# EAGLE design LPC_4TE_3.31 (EAGLE 5.00)
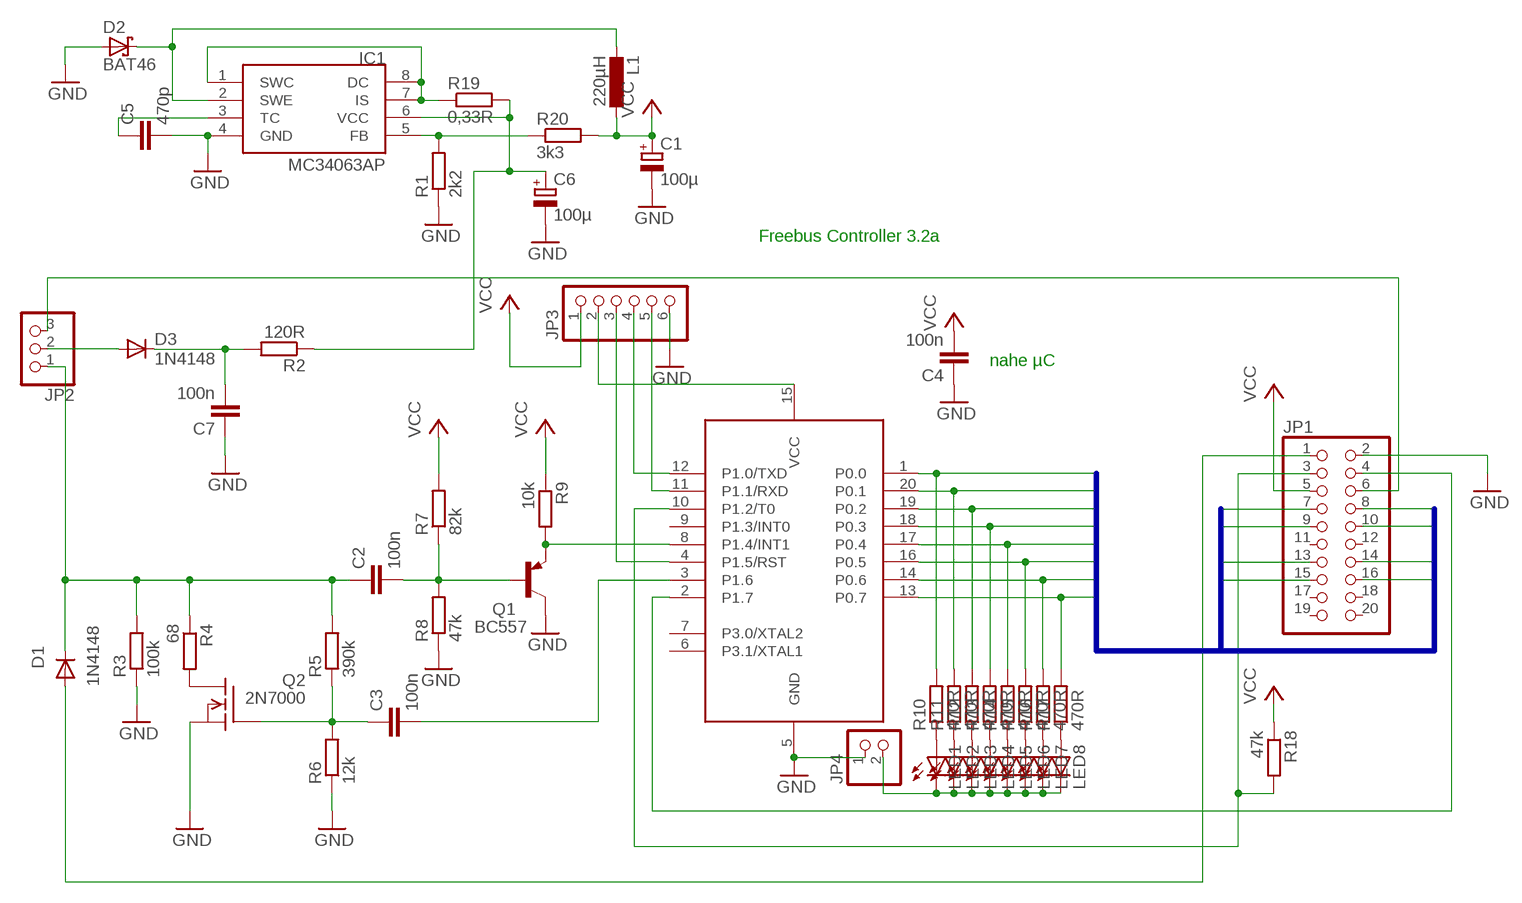
[diagram p0: schematic, sheet 1]

## Parts
C1  100µ  CPOL-EUE5-8.5  [E5-8,5]
C2  100n  C-EU050-024X044  [C050-024X044]
C3  100n  C-EU050-024X044  [C050-024X044]
C4  100n  C-EU050-024X044  [C050-024X044]
C5  470p  C-EU025-024X044  [C025-024X044]
C6  100µ  CPOL-EUE5-8.5  [E5-8,5]
C7  100n  C-EU050-024X044  [C050-024X044]
D1  1N4148  [DO35-10]
D2  BAT46  BAT49  [DO41-10]
D3  1N4148  [DO35-10]
IC1  MC34063AP  [DIL08]
JP1  PINHD-2X10  [2X10]
JP2  PINHD-1X3  [1X03]
JP3  PINHD-1X6  [1X06]
JP4  PINHD-1X2  [1X02]
L1  220µH  L-EU2200-12.7  [2200-12.7]
LED1  LED3MM  [LED3MM]
LED2  LED3MM  [LED3MM]
LED3  LED3MM  [LED3MM]
LED4  LED3MM  [LED3MM]
LED5  LED3MM  [LED3MM]
LED6  LED3MM  [LED3MM]
LED7  LED3MM  [LED3MM]
LED8  LED3MM  [LED3MM]
Q1  BC557  [TO92]
Q2  2N7000  VN2222KM  [TO237]
R1  2k2  R-EU_0207/10  [0207/10]
R2  120R  R-EU_0207/10  [0207/10]
R3  100k  R-EU_0207/10  [0207/10]
R4  68  R-EU_0207/10  [0207/10]
R5  390k  R-EU_0207/10  [0207/10]
R6  12k  R-EU_0207/10  [0207/10]
R7  82k  R-EU_0207/10  [0207/10]
R8  47k  R-EU_0207/10  [0207/10]
R9  10k  R-EU_0207/10  [0207/10]
R10  470R  R-EU_0207/10  [0207/10]
R11  470R  R-EU_0207/10  [0207/10]
R12  470R  R-EU_0207/10  [0207/10]
R13  470R  R-EU_0207/10  [0207/10]
R14  470R  R-EU_0207/10  [0207/10]
R15  470R  R-EU_0207/10  [0207/10]
R16  470R  R-EU_0207/10  [0207/10]
R17  470R  R-EU_0207/10  [0207/10]
R18  47k  R-EU_0207/10  [0207/10]
R19  0,33R  R-EU_0207/10  [0207/10]
R20  3k3  R-EU_0207/10  [0207/10]
U1  89LPC922  [DIL20]

## Nets
GND: C1.- C4.1 C5.2 C6.- C7.1 D2.A IC1.4(GND) JP1.2 JP3.6 JP4.1 Q1.3(C) Q2.3(S) R1.1 R3.1 R6.1 R8.1 U1.5(GND)
N$1: Q1.1(E) R9.2 U1.8(P1.4/INT1)
N$2: C2.2 Q1.2(B) R7.1 R8.2
N$3: IC1.5(FB) R1.2 R20.1
N$4: IC1.1(SWC) IC1.7(IS) IC1.8(DC) R19.1
N$5: C3.2 U1.3(P1.6)
N$6: Q2.1(D) R4.2
N$7: C6.+ IC1.6(VCC) R2.1 R19.2
N$8: D3.A JP2.2
N$9: C2.1 D1.C JP2.1 R3.2 R4.1 R5.2
N$10: D2.C IC1.2(SWE) L1.2
N$11: C7.2 D3.C R2.2
N$13: C5.1 IC1.3(TC)
N$16: D1.A JP1.1
N$17: JP1.4 U1.2(P1.7)
N$19: JP1.6 JP2.3
N$20: LED1.A R10.1
N$21: LED2.A R11.1
N$22: LED3.A R12.1
N$23: LED4.A R13.1
N$24: LED5.A R14.1
N$25: LED6.A R15.1
N$26: LED7.A R16.1
N$27: LED8.A R17.1
N$28: JP4.2 LED1.K(C) LED2.K(C) LED3.K(C) LED4.K(C) LED5.K(C) LED6.K(C) LED7.K(C) LED8.K(C)
N$29: JP3.4 U1.12(P1.0/TXD)
N$30: JP3.5 U1.11(P1.1/RXD)
N$31: JP3.3 U1.4(P1.5/RST)
N$32: JP3.2 U1.15(VCC)
N$33: JP1.3 R18.2 U1.10(P1.2/T0)
N$34: C3.1 Q2.2(G) R5.1 R6.2
P0.0: JP1.7 R10.2 U1.1(P0.0)
P0.1: JP1.8 R11.2 U1.20(P0.1)
P0.2: JP1.9 R12.2 U1.19(P0.2)
P0.3: JP1.10 R13.2 U1.18(P0.3)
P0.4: JP1.13 R14.2 U1.17(P0.4)
P0.5: JP1.14 R15.2 U1.16(P0.5)
P0.6: JP1.15 R16.2 U1.14(P0.6)
P0.7: JP1.16 R17.2 U1.13(P0.7)
VCC: C1.+ C4.2 JP1.5 JP3.1 L1.1 R7.2 R9.1 R18.1 R20.2
Unconnected: JP1.11 JP1.12 JP1.17 JP1.18 JP1.19 JP1.20 U1.6(P3.1/XTAL1) U1.7(P3.0/XTAL2) U1.9(P1.3/INT0)

## Buses
P0.[0..7]

## Notes on the sheet
- Freebus Controller 3.2a
- nahe µC

## Library data of the parts
C1 C6 = rcl:CPOL-EU: POLARIZED CAPACITOR, European symbol
C2-C5 C7 = rcl:C-EU: CAPACITOR, European symbol
D1 D3 = diode:1N4148: DIODE high speed (Philips)
D2 = diode:BAT49: DIODE small signal diode
IC1 = mc34063:MC34063
JP1 = pinhead:PINHD-2X10: PIN HEADER
JP2 = pinhead:PINHD-1X3: PIN HEADER
JP3 = pinhead:PINHD-1X6: PIN HEADER
JP4 = pinhead:PINHD-1X2: PIN HEADER
L1 = rcl:L-EU: INDUCTOR, European symbol
LED1-LED8 = led:LED: LED OSRAM: - CHIPLED LG R971, LG N971, LY N971, LG Q971, LY Q971, LO R971, LY R971 LH N974, LH R974 LS Q976, LO Q976, LY Q976 LO Q996 - Hyper CHIPLED LW Q18S LB Q993, LB Q99A, LB R99A - SideLED LS A670, LO A670, LY A670, LG A670, LP A670 LB A673, LV A673, LT A673, LW A673 LH A674 LY A675 LS A676, LA A676, LO A676, LY A676, LW A676 LS A679, LY A679, LG A679 - Hyper Micro SIDELED® LS Y876, LA Y876, LO Y876, LY Y876 LT Y87S - SmartLED LW L88C, LW L88S LB L89C, LB L89S, LG L890 LS L89K, LO L89K, LY L89K LS L896, LA L896, LO L896, LY L896 - TOPLED LS T670, LO T670, LY T670, LG T670, LP T670 LSG T670, LSP T670, LSY T670, LOP T670, LYG T670 LG T671, LOG T671, LSG T671 LB T673, LV T673, LT T673, LW T673 LH T674 LS T676, LA T676, LO T676, LY T676, LB T676, LH T676, LSB T676, LW T676 LB T67C, LV T67C, LT T67C, LS T67K, LO T67K, LY T67K, LW E67C LS E67B, LA E67B, LO E67B, LY E67B, LB E67C, LV E67C, LT E67C LW T67C LS T679, LY T679, LG T679 LS T770, LO T770, LY T770, LG T770, LP T770 LB T773, LV T773, LT T773, LW T773 LH T774 LS E675, LA E675, LY E675, LS T675 LS T776, LA T776, LO T776, LY T776, LB T776 LHGB T686 LT T68C, LB T68C - Hyper Mini TOPLED® LB M676 - Mini TOPLED Santana® LG M470 LS M47K, LO M47K, LY M47K Source: http://www.osram.convergy.de - LUMILED® LXK2-PW12-R00, LXK2-PW12-S00, LXK2-PW14-U00, LXK2-PW14-V00 LXK2-PM12-R00, LXK2-PM12-S00, LXK2-PM14-U00 LXK2-PE12-Q00, LXK2-PE12-R00, LXK2-PE12-S00, LXK2-PE14-T00, LXK2-PE14-U00 LXK2-PB12-K00, LXK2-PB12-L00, LXK2-PB12-M00, LXK2-PB14-N00, LXK2-PB14-P00, LXK2-PB14-Q00 LXK2-PR12-L00, LXK2-PR12-M00, LXK2-PR14-Q00, LXK2-PR14-R00 LXK2-PD12-Q00, LXK2-PD12-R00, LXK2-PD12-S00 LXK2-PH12-R00, LXK2-PH12-S00 LXK2-PL12-P00, LXK2-PL12-Q00, LXK2-PL12-R00 Source: www.luxeon.com
Q1 = transistor-pnp:BC557: PNP Transistor
Q2 = transistor-fet:VN2222KM: N-Channel Enhancement MOSFET (VMOS); 60V; 0,5A; 7,5Ohm
R1-R20 = rcl:R-EU_: RESISTOR, European symbol
U1 = micro-philips:89LPC922

## Board
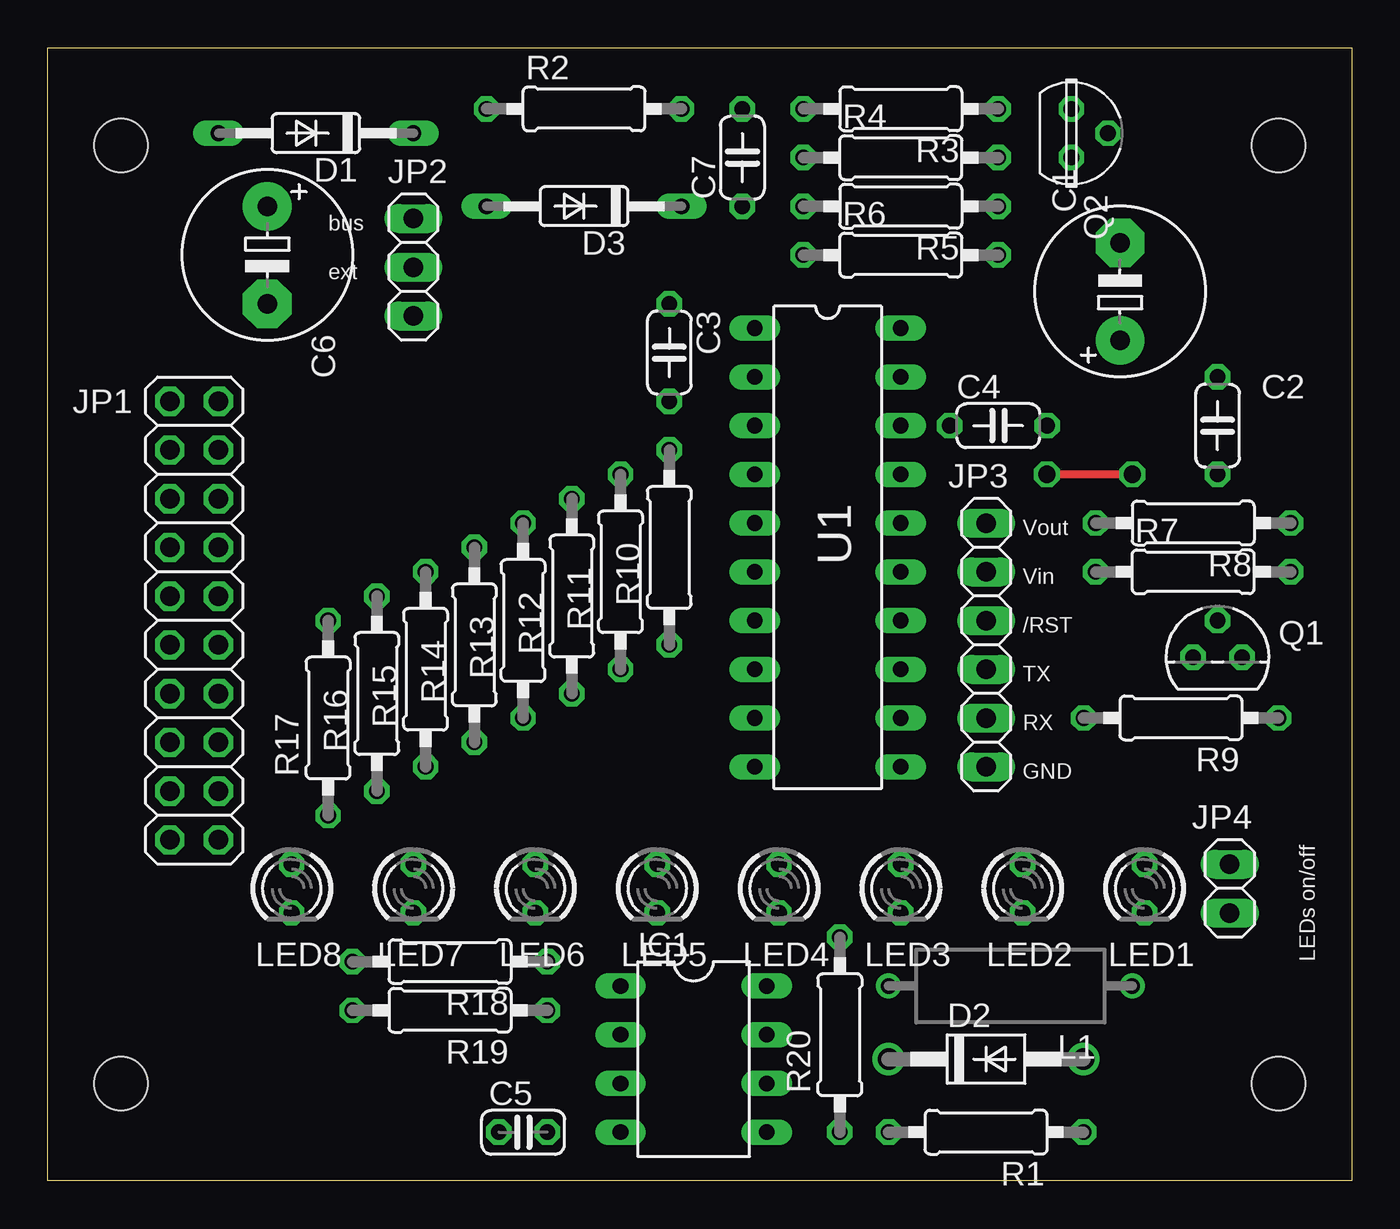
[diagram p1: board, top side]
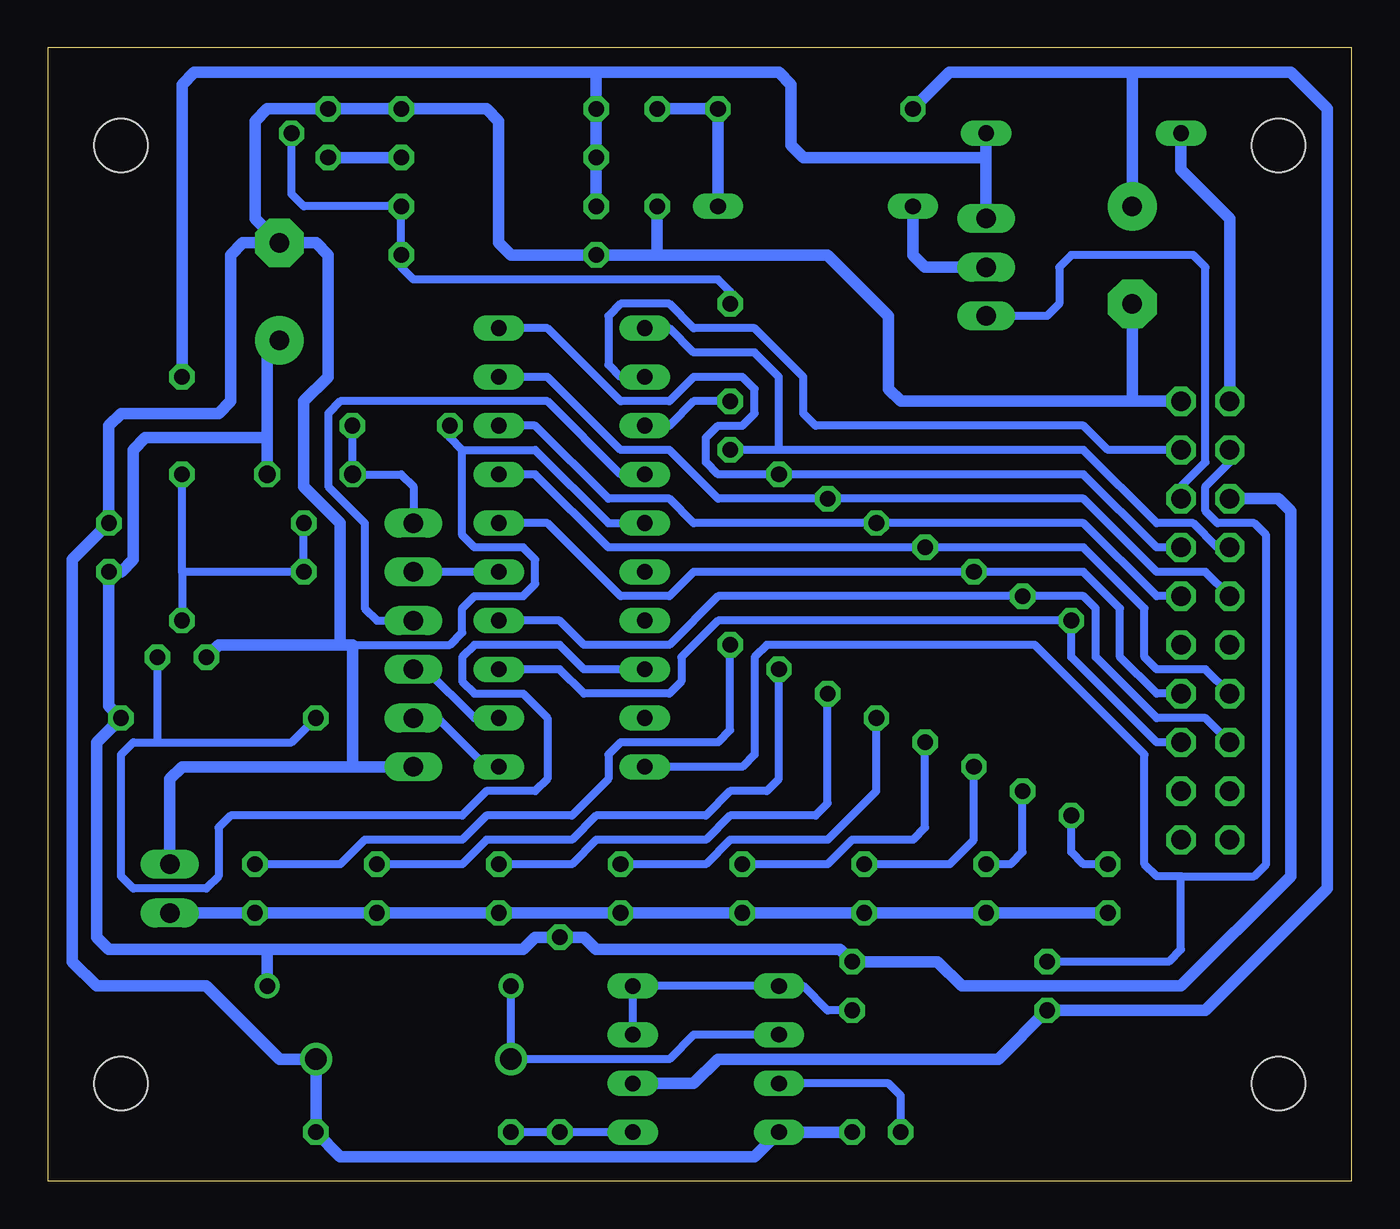
[diagram p2: board, bottom side, seen from below]

Size 67.94 x 59.05 mm. Coordinates in mm from the lower left corner, seen from the top.
Outline: 0,0 0,59.05 67.94,59.05 67.94,0 0,0
Copper layers (1*16): Top 0.035mm / dielectric 1.5mm / Bottom 0.035mm
Design rules "default": minimum track width 10mil, minimum drill 24mil, track to track 12mil, track to pad 12mil, pad to pad 12mil, via to via 12mil, smd to smd 8mil, copper to edge 20mil, drill to drill 8mil, minimum pad ring 10mil, minimum via ring 8mil, stop-mask expansion 4mil, vias tented up to drill 0mil, thermal gap 10mil
Holes 2.8 mm at 3.81,53.98 64.14,53.98 64.14,5.08 3.81,5.08

### Footprints (pad centres in the part's own frame; a part is rotated, then mirrored left to right if it is on the bottom)
E5-8,5 = drill 1.016 pad 2.54 round: + -2.54,0 | drill 1.016 pad 2.54 octagon: - 2.54,0
C050-024X044 = drill 0.813 octagon: 1 -2.54,0; 2 2.54,0
C025-024X044 = drill 0.813 octagon: 1 -1.27,0; 2 1.27,0
DO35-10 = drill 0.813 long: A 5.08,0; C -5.08,0
DO41-10 = drill 1.118 round: A 5.08,0; C -5.08,0
DIL08 = drill 0.813 long: 1 -3.81,-3.81; 2 -1.27,-3.81; 3 1.27,-3.81; 4 3.81,-3.81; 5 3.81,3.81; 6 1.27,3.81; 7 -1.27,3.81; 8 -3.81,3.81
2X10 = drill 1.016 octagon: 1 -11.43,-1.27; 2 -11.43,1.27; 3 -8.89,-1.27; 4 -8.89,1.27; 5 -6.35,-1.27; 6 -6.35,1.27; 7 -3.81,-1.27; 8 -3.81,1.27; 9 -1.27,-1.27; 10 -1.27,1.27; 11 1.27,-1.27; 12 1.27,1.27; 13 3.81,-1.27; 14 3.81,1.27; 15 6.35,-1.27; 16 6.35,1.27; 17 8.89,-1.27; 18 8.89,1.27; 19 11.43,-1.27; 20 11.43,1.27
1X03 = drill 1.016 long: 1 -2.54,0; 2 0,0; 3 2.54,0
1X06 = drill 1.016 long: 1 -6.35,0; 2 -3.81,0; 3 -1.27,0; 4 1.27,0; 5 3.81,0; 6 6.35,0
1X02 = drill 1.016 long: 1 -1.27,0; 2 1.27,0
2200-12.7 = drill 0.8 pad 1.27 round: 1 -6.35,0; 2 6.35,0
LED3MM = drill 0.813 octagon: A -1.27,0; K 1.27,0
TO92 = drill 0.813 octagon: 1 1.27,0; 2 0,1.905; 3 -1.27,0
TO237 = drill 0.813 octagon: 1 1.27,0; 2 0,1.905; 3 -1.27,0
0207/10 = drill 0.813 octagon: 1 -5.08,0; 2 5.08,0
DIL20 = drill 0.813 long: 1 -11.43,-3.81; 2 -8.89,-3.81; 3 -6.35,-3.81; 4 -3.81,-3.81; 5 -1.27,-3.81; 6 1.27,-3.81; 7 3.81,-3.81; 8 6.35,-3.81; 9 8.89,-3.81; 10 11.43,-3.81; 11 11.43,3.81; 12 8.89,3.81; 13 6.35,3.81; 14 3.81,3.81; 15 1.27,3.81; 16 -1.27,3.81; 17 -3.81,3.81; 18 -6.35,3.81; 19 -8.89,3.81; 20 -11.43,3.81

### Placement (x,y rotation side)
C1  55.88,46.35 90 top
C2  60.96,39.37 270 top
C3  32.38,43.18 270 top
C4  49.53,39.37 0 top
C5  24.77,2.54 0 top
C6  11.43,48.26 270 top
C7  36.2,53.34 90 top
D1  13.97,54.61 180 top
D2  48.9,6.35 0 top
D3  27.94,50.8 180 top
IC1  33.66,6.35 270 top
JP1  7.62,29.21 270 top
JP2  19.05,47.62 270 top
JP3  48.9,27.94 270 top
JP4  61.59,15.24 270 top
L1  50.16,10.16 180 top
LED1  57.15,15.24 270 top
LED2  50.8,15.24 270 top
LED3  44.45,15.24 270 top
LED4  38.1,15.24 270 top
LED5  31.75,15.24 270 top
LED6  25.4,15.24 270 top
LED7  19.05,15.24 270 top
LED8  12.7,15.24 270 top
Q1  60.96,27.3 0 top
Q2  53.34,54.61 270 top
R1  48.9,2.54 180 top
R2  27.94,55.88 0 top
R3  44.45,55.88 180 top
R4  44.45,53.34 0 top
R5  44.45,50.8 180 top
R6  44.45,48.26 0 top
R7  59.69,31.75 0 top
R8  59.69,34.29 180 top
R9  59.05,24.13 180 top
R10  32.38,33.02 90 top
R11  29.84,31.75 90 top
R12  27.3,30.48 90 top
R13  24.77,29.21 90 top
R14  22.23,27.94 90 top
R15  19.68,26.67 90 top
R16  17.14,25.4 90 top
R17  14.61,24.13 90 top
R18  20.95,11.43 180 top
R19  20.95,8.89 180 top
R20  41.27,7.62 90 top
U1  40.64,33.02 270 top

### Tracks (layer width: path | path; a pad name or v marks a point on that pad's centre or on a via)
GND
  Bottom 0.406: U1.5 38.73,34.29 42.55,38.1 46.35,38.1 | 52.07,27.94 46.99,27.94 46.35,28.57 46.35,29.84 45.72,30.48 43.18,30.48 42.55,31.11 42.55,32.38 43.18,33.02 45.72,33.02 46.35,33.66 46.35,38.1 | C4.1 46.99,38.73 46.35,38.1
  Bottom 0.61: JP1.2 11.43,40.64 | 11.43,40.64 23.5,40.64 24.13,41.27 24.13,45.09 27.3,48.26 36.2,48.26 | JP4.1 61.59,20.95 60.96,21.59 52.07,21.59 | 52.07,21.59 JP3.6 | 52.07,21.59 52.07,27.94 52.7,27.94 | 52.7,27.94 59.05,27.94 Q1.3 | 11.43,40.64 C6.- | 36.2,48.26 R6.1 43.81,48.26 44.45,48.9 44.45,55.24 45.09,55.88 R3.1 Q2.3 56.52,55.88 57.15,55.24 57.15,50.16 C1.- | 52.7,27.94 52.7,34.29 54.61,36.2 54.61,40.64 53.34,41.91 53.34,48.26 53.98,48.9 C1.- | 36.2,48.26 C7.1 | C1.- 57.78,48.9 58.42,48.26 58.42,40.64 59.05,40.01 64.14,40.01 64.77,39.37 R8.1 66.67,32.38 66.67,11.43 65.41,10.16 59.69,10.16 55.88,6.35 D2.A R1.1 52.7,1.27 31.11,1.27 IC1.4 C5.2
N$1
  Bottom 0.406: U1.8 40.01,26.67 41.27,27.94 45.72,27.94 46.35,27.3 46.35,26.04 45.72,25.4 43.18,25.4 41.91,24.13 41.91,20.95 42.55,20.32 45.09,20.32 46.35,19.05 58.42,19.05 59.05,18.41 59.05,15.88 59.69,15.24 63.5,15.24 64.14,15.88 64.14,22.23 63.5,22.86 62.23,22.86 | 62.23,22.86 55.24,22.86 R9.2 | 62.23,22.86 Q1.1
N$2
  Bottom 0.406: 60.96,31.75 Q1.2 | 60.96,31.75 R7.1 R8.2 | 60.96,31.75 C2.2
N$3
  Bottom 0.406: IC1.5 R20.1 R1.2
N$4
  Bottom 0.406: IC1.7 IC1.8 IC1.1 28.57,10.16 27.3,8.89 R19.1
N$5
  Bottom 0.406: C3.2 34.29,40.64 35.56,39.37 U1.3
N$6
  Bottom 0.61: R4.2 Q2.1
N$7
  Bottom 0.61: IC1.6 34.29,5.08 33.02,6.35 18.41,6.35 R19.2 7.62,8.89 1.27,15.24 1.27,55.88 3.17,57.78 11.43,57.78 | 11.43,57.78 20.95,57.78 R2.1 | 11.43,57.78 C6.+
N$8
  Bottom 0.61: JP2.2 22.23,47.62 22.86,48.26 D3.A
N$9
  Bottom 0.61: R5.2 R4.1 R3.2 39.37,57.78 | C2.1 60.96,57.15 60.33,57.78 39.37,57.78 | JP2.1 19.05,53.34 | 19.05,53.34 D1.C | 39.37,57.78 29.84,57.78 29.21,57.15 29.21,53.98 28.57,53.34 19.05,53.34
N$10
  Bottom 0.406: IC1.2 34.29,7.62 35.56,6.35 D2.C L1.2
N$11
  Bottom 0.61: D3.C R2.2 C7.2
N$13
  Bottom 0.406: IC1.3 24.13,5.08 23.5,4.45 C5.1
N$16
  Bottom 0.61: JP1.1 6.35,50.16 8.89,52.7 D1.A
N$17
  Bottom 0.406: JP1.4 12.7,38.1 13.97,39.37 27.94,39.37 28.57,40.01 28.57,41.91 31.11,44.45 34.29,44.45 35.56,45.72 38.1,45.72 38.73,45.09 38.73,42.55 38.1,41.91 U1.2
N$19
  Bottom 0.406: JP1.6 8.89,36.2 7.62,37.47 7.62,47.62 8.26,48.26 14.61,48.26 15.24,47.62 15.24,45.72 15.88,45.09 JP2.3
N$20
  Bottom 0.406: LED1.A 52.7,16.51 51.44,17.78 46.35,17.78 45.09,19.05 40.64,19.05 38.73,20.95 38.73,22.23 38.1,22.86 33.02,22.86 32.38,23.5 R10.1
N$21
  Bottom 0.406: R11.1 29.84,20.95 30.48,20.32 32.38,20.32 33.66,19.05 39.37,19.05 40.64,17.78 45.09,17.78 46.35,16.51 LED2.A
N$22
  Bottom 0.406: R12.1 27.3,19.68 27.94,19.05 32.38,19.05 33.66,17.78 39.37,17.78 40.64,16.51 LED3.A
N$23
  Bottom 0.406: R13.1 24.77,20.32 27.3,17.78 32.38,17.78 33.66,16.51 LED4.A
N$24
  Bottom 0.406: R14.1 22.23,18.41 22.86,17.78 26.04,17.78 27.3,16.51 LED5.A
N$25
  Bottom 0.406: R15.1 19.68,17.78 20.95,16.51 LED6.A
N$26
  Bottom 0.406: R16.1 17.14,17.14 17.78,16.51 LED7.A
N$27
  Bottom 0.406: R17.1 14.61,17.14 13.97,16.51 LED8.A
N$28
  Bottom 0.61: JP4.2 LED1.K LED2.K LED3.K LED4.K LED5.K LED6.K LED7.K LED8.K
N$29
  Bottom 0.406: U1.12 45.72,24.13 48.26,26.67 JP3.4
N$30
  Bottom 0.406: U1.11 45.09,21.59 47.62,24.13 JP3.5
N$31
  Bottom 0.406: U1.4 38.1,36.83 41.91,40.64 52.7,40.64 53.34,40.01 53.34,36.2 51.44,34.29 51.44,29.84 50.8,29.21 JP3.3
N$32
  Bottom 0.406: U1.15 JP3.2
N$33
  Bottom 0.406: 8.89,15.88 5.08,15.88 4.45,16.51 4.45,33.66 5.08,34.29 6.99,34.29 7.62,34.92 7.62,36.2 6.35,37.47 JP1.3 | 8.89,15.88 10.16,15.88 10.79,16.51 10.79,22.23 16.51,27.94 30.48,27.94 31.11,27.3 31.11,22.23 31.75,21.59 U1.10 | R18.2 9.53,11.43 8.89,12.06 8.89,15.88
N$34
  Bottom 0.406: Q2.2 55.24,51.44 54.61,50.8 R5.1 R6.2 49.53,47.62 48.9,46.99 33.02,46.99 32.38,46.35 C3.1
P0.0
  Bottom 0.406: JP1.7 6.99,33.02 8.26,34.29 10.16,34.29 13.97,38.1 29.84,38.1 | 29.84,38.1 R10.2 | U1.1 35.56,44.45 34.29,43.18 31.11,43.18 29.84,41.91 29.84,38.1
P0.1
  Bottom 0.406: JP1.8 10.16,33.02 13.97,36.83 R11.2 33.02,36.83 33.66,37.47 33.66,38.73 33.02,39.37 31.75,39.37 31.11,40.01 31.11,41.27 31.75,41.91 34.29,41.91 35.56,40.64 38.1,40.64 41.91,44.45 U1.20
P0.2
  Bottom 0.406: JP1.9 7.62,31.75 10.16,31.75 13.97,35.56 R12.2 33.02,35.56 35.56,38.1 38.1,38.1 41.91,41.91 U1.19
P0.3
  Bottom 0.406: JP1.10 10.16,30.48 13.97,34.29 R13.2 34.29,34.29 35.56,35.56 38.73,35.56 42.55,39.37 U1.18
P0.4
  Bottom 0.406: JP1.13 7.62,26.67 10.16,26.67 10.79,27.3 10.79,29.84 13.97,33.02 R14.2 38.73,33.02 42.55,36.83 U1.17
P0.5
  Bottom 0.406: JP1.14 10.16,25.4 12.06,27.3 12.06,29.84 13.97,31.75 R15.2 34.29,31.75 35.56,30.48 38.1,30.48 41.91,34.29 U1.16
P0.6
  Bottom 0.406: JP1.15 7.62,24.13 10.16,24.13 13.34,27.3 13.34,29.84 13.97,30.48 R16.2 33.02,30.48 35.56,27.94 40.01,27.94 41.27,29.21 U1.14
P0.7
  Bottom 0.406: JP1.16 10.16,22.86 14.61,27.3 R17.2 33.02,29.21 34.92,27.3 34.92,26.04 35.56,25.4 40.01,25.4 41.27,26.67 U1.13
VCC  (via drill 0.9)
  Top 0.406: v56.52,36.83 v52.07,36.83
  Bottom 0.406: JP3.1 48.9,36.2 49.53,36.83 v52.07,36.83 C4.2 | v56.52,36.83 56.52,37.47
  Bottom 0.61: JP1.5 3.81,35.56 3.17,34.92 3.17,15.88 8.89,10.16 20.32,10.16 21.59,11.43 R18.1 26.67,12.06 39.37,12.06 40.01,12.7 R20.2 42.55,12.7 43.18,12.06 56.52,12.06 | C1.+ 56.52,43.18 56.52,38.73 | 56.52,38.73 v56.52,36.83 | 56.52,38.73 62.87,38.73 63.5,38.1 63.5,32.38 64.14,31.75 R7.2 64.77,24.77 R9.1 65.41,22.86 65.41,12.7 64.77,12.06 56.52,12.06 | L1.1 56.52,12.06

### Text on the board
tPlace: bus | ext | Vout | Vin | /RST | TX | RX | GND | LEDs on/off